# EAGLE schematic TP2 - Partie Données  (EAGLE 9.6.2)
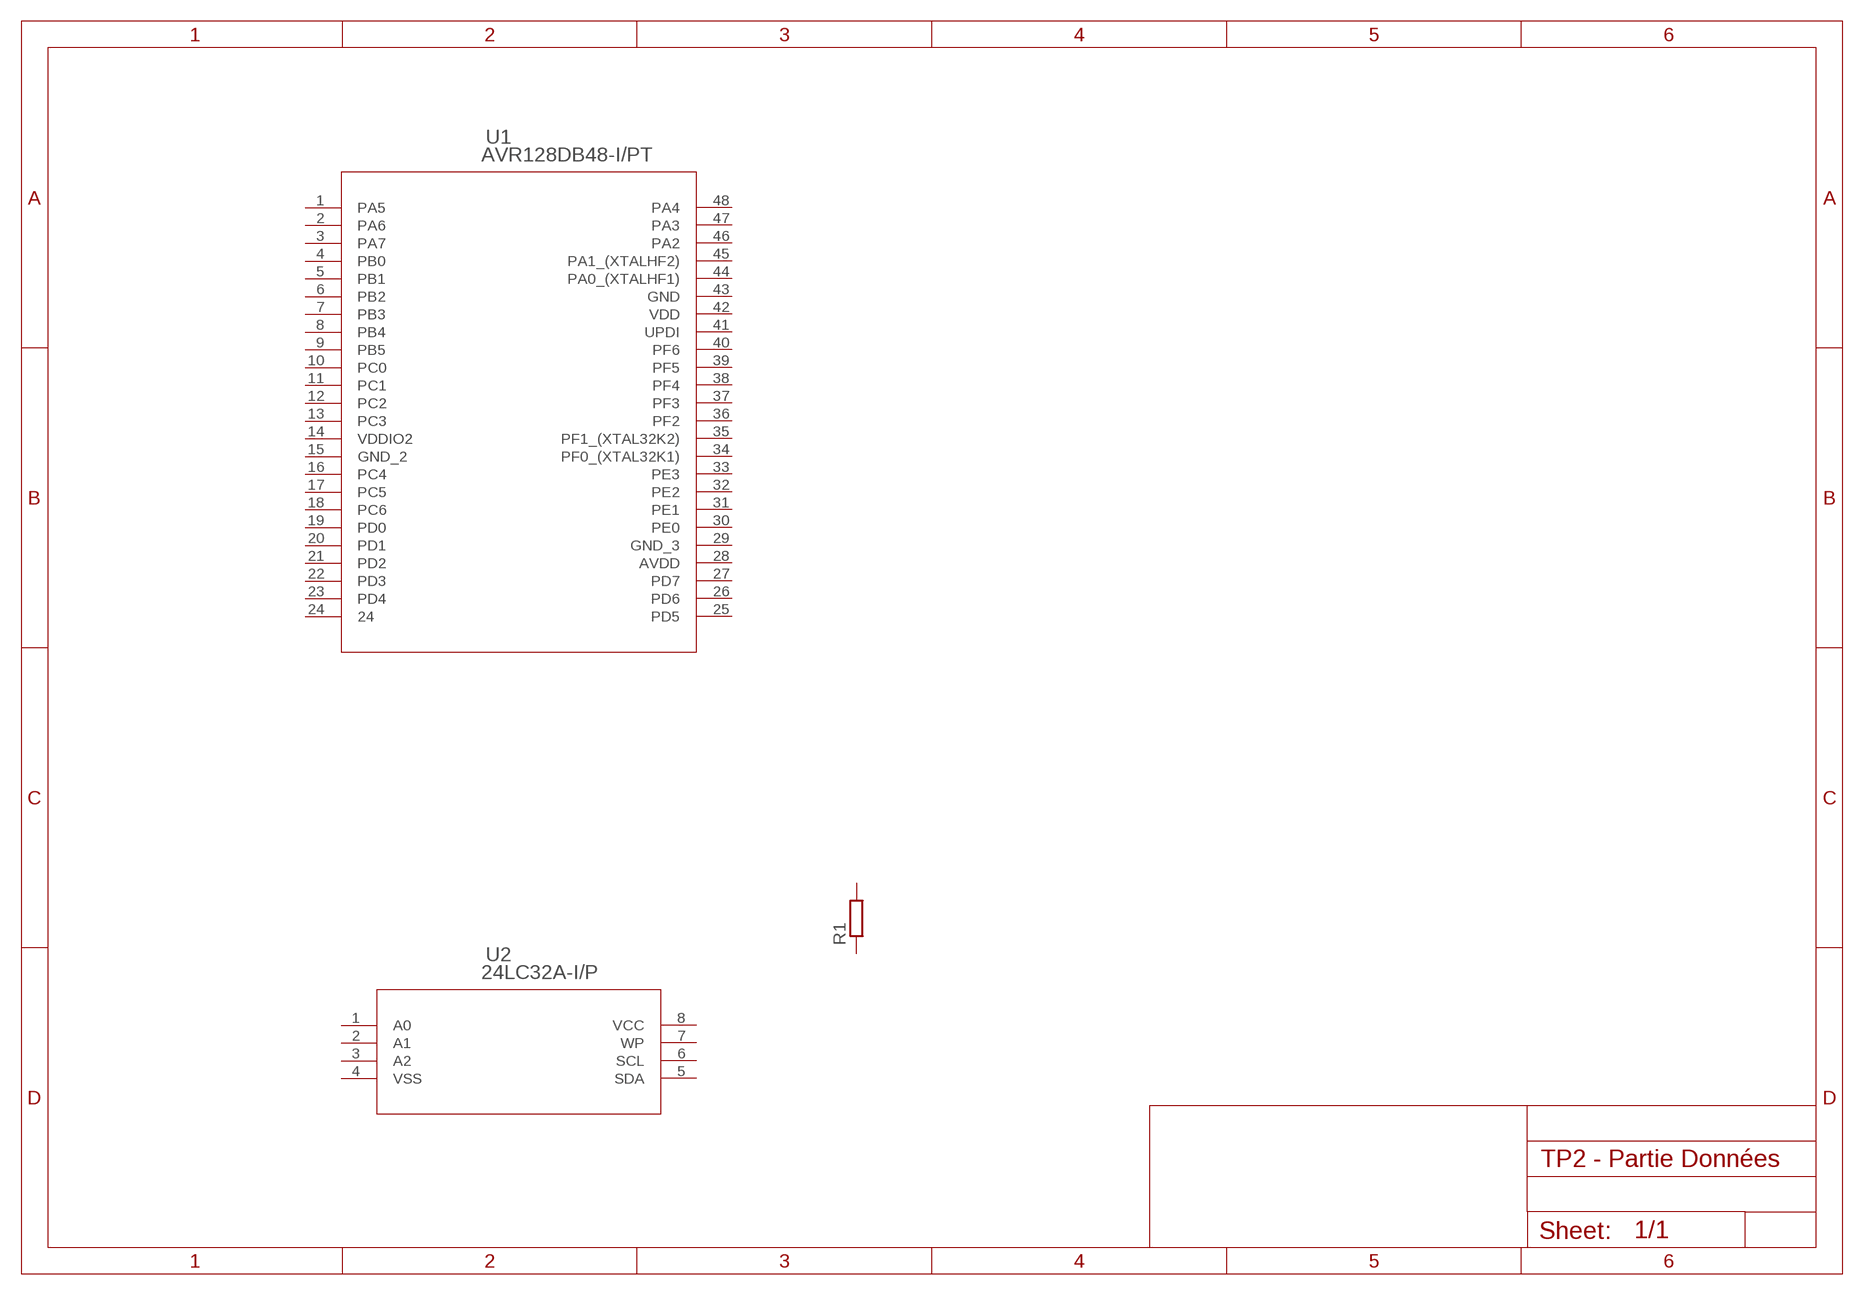
[diagram p0: schematic, sheet 1]

## Parts
R1  R-EU_R1206  [R1206]
U1  AVR128DB48-I/PT  [TQFP48_PT_MCH]
U2  24LC32A-I/P  [PDIP8_300MC_MCH]
Unconnected: R1.1 R1.2 U1.1(PA5) U1.2(PA6) U1.3(PA7) U1.4(PB0) U1.5(PB1) U1.6(PB2) U1.7(PB3) U1.8(PB4) U1.9(PB5) U1.10(PC0) U1.11(PC1) U1.12(PC2) U1.13(PC3) U1.15(GND_2) U1.16(PC4) U1.17(PC5) U1.18(PC6) U1.19(PD0) U1.20(PD1) U1.21(PD2) U1.22(PD3) U1.23(PD4) U1.24 U1.25(PD5) U1.26(PD6) U1.27(PD7) U1.29(GND_3) U1.30(PE0) U1.31(PE1) U1.32(PE2) U1.33(PE3) U1.34(PF0_(XTAL32K1)) U1.35(PF1_(XTAL32K2)) U1.36(PF2) U1.37(PF3) U1.38(PF4) U1.39(PF5) U1.40(PF6) U1.41(UPDI) U1.43(GND) U1.44(PA0_(XTALHF1)) U1.45(PA1_(XTALHF2)) U1.46(PA2) U1.47(PA3) U1.48(PA4) U2.1(A0) U2.2(A1) U2.3(A2) U2.4(VSS) U2.5(SDA) U2.6(SCL) U2.7(WP) U2.8(VCC)

## Power pins joined to a net without a drawn wire
AVDD: U1.28(AVDD)
VDD: U1.42(VDD)
VDDIO2: U1.14(VDDIO2)

## Library data of the parts
R1 = rcl:R-EU_: RESISTOR, European symbol; SPICEPREFIX: R
U1 = AVR128DB48-IPT:AVR128DB48-I/PT; COPYRIGHT: Copyright (C) 2024 Ultra Librarian. All rights reserved.; MANUFACTURER_PART_NUMBER: AVR128DB48-I/PT; MFR_NAME: Microchip
U2 = 24LC32A-IP:24LC32A-I/P; COPYRIGHT: Copyright (C) 2024 Ultra Librarian. All rights reserved.; MANUFACTURER_PART_NUMBER: 24LC32A-I/P; MFR_NAME: Microchip